# EAGLE design BSPD Test Board manufactured 2016-11-03 (EAGLE 7.7.0)
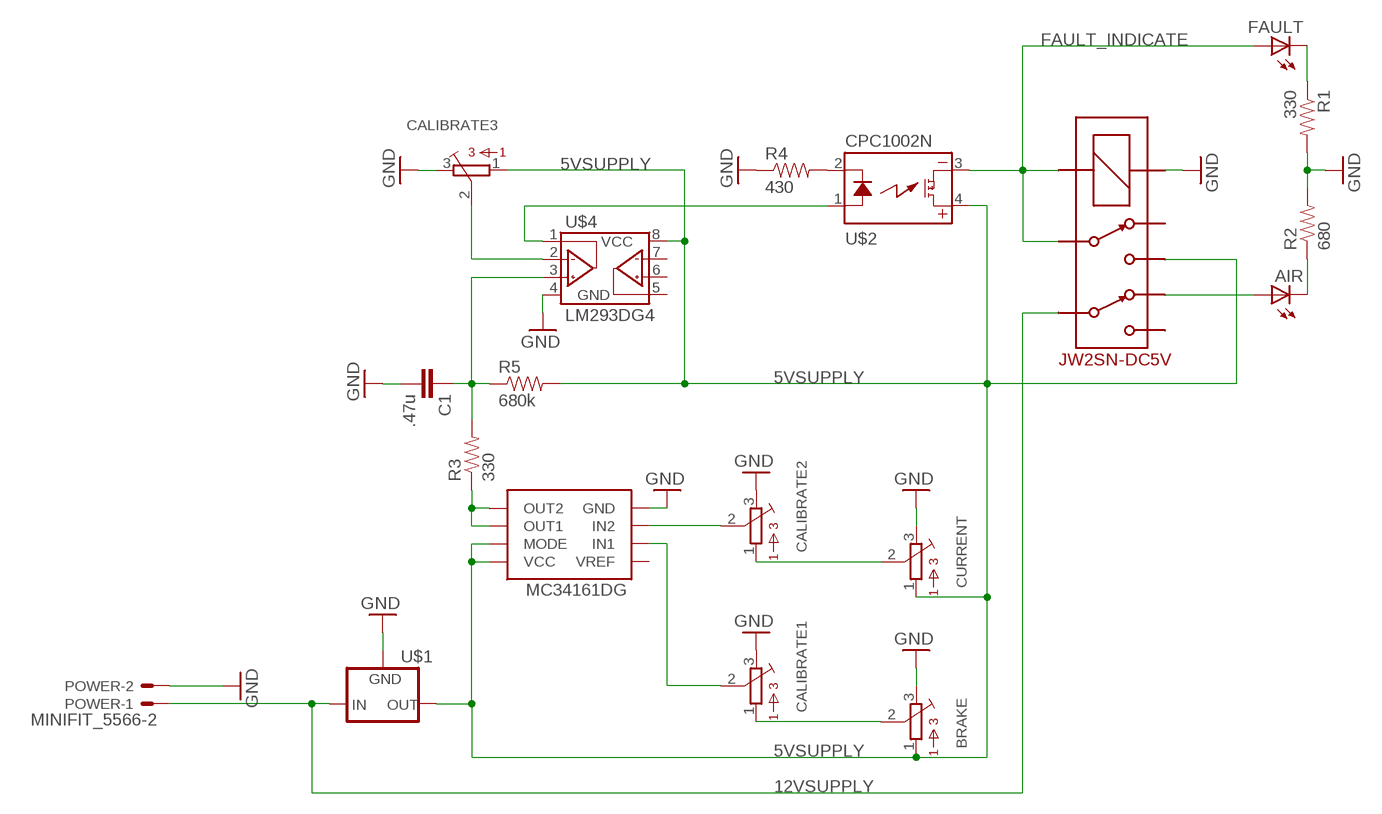
[diagram p0: schematic, sheet 1]

## Parts
AIR  LED-5MM  [LED-5MM]
BRAKE  TRIMPOT_3296C  [TRIMPOT_3296]
C1  .47u  CAPEZ  [CAP-PTH-SMALLEZ]
CALIBRATE1  TRIMPOT_3296C  [TRIMPOT_3296]
CALIBRATE2  TRIMPOT_3296C  [TRIMPOT_3296]
CALIBRATE3  TRIMPOT_3296C  [TRIMPOT_3296]
CURRENT  TRIMPOT_3296C  [TRIMPOT_3296]
FAULT  LED-5MM  [LED-5MM]
MC34161DG  VOLTAGE_MONITOR_MC34161DG  [SOIC-08]
POWER  MINIFIT_5566-2  [MINIFIT_5566-2]
R1  330  RESISTOR0805-RES  [0805]
R2  680  RESISTOR0805-RES  [0805]
R3  330  RESISTOR0805-RES  [0805]
R4  430  RESISTOR0805-RES  [0805]
R5  680k  RESISTOREZ  [AXIAL-0.3EZ]
U$1  5V_REGULATOR_LM340-NLM340MPX-5.0/NOPB  [SOT223]
U$2  CPC1002N  [SOP04]
U$3  DPDT_RELAY_PANASONIC_JW2SN-DC5V  [DPDT_RELAY_PANASONIC_JW2SN]
U$4  LM293DG4  [SOIC-08]

## Nets
5VSUPPLY: BRAKE.1 CALIBRATE3.1 CURRENT.1 MC34161DG.7(MODE) MC34161DG.8(VCC) R5.P$2 U$1.3(OUT) U$2.4(DC+) U$3.4 U$4.8(VCC)
12VSUPPLY: POWER.1 U$1.1(IN) U$3.6
FAULT_INDICATE: FAULT.A U$2.3(DC-) U$3.3 U$3.COIL-
GND: BRAKE.3 C1.2 CALIBRATE1.3 CALIBRATE2.3 CALIBRATE3.3 CURRENT.3 MC34161DG.4(GND) POWER.2 R1.2 R2.2 R4.1 U$1.2(GND) U$1.4(GND) U$3.COIL+ U$4.4(GND)
N$3: BRAKE.2 CALIBRATE1.1
N$4: CALIBRATE2.1 CURRENT.2
N$5: CALIBRATE2.2 MC34161DG.3(IN2)
N$6: CALIBRATE1.2 MC34161DG.2(IN1)
N$7: CALIBRATE3.2 U$4.2(1IN-)
N$8: FAULT.K(C) R1.1
N$9: U$2.1(CONTROL+) U$4.1(1OUT)
N$10: R4.2 U$2.2(CONTROL-)
N$11: AIR.A U$3.7
N$12: AIR.K(C) R2.1
N$13: C1.1 R3.2 R5.P$1 U$4.3(1IN+)
N$14: MC34161DG.5(OUT2) MC34161DG.6(OUT1) R3.1
Unconnected: MC34161DG.1(VREF) U$3.2 U$3.5 U$4.5(2IN+) U$4.6(2IN-) U$4.7(2OUT)

## Library data of the parts
AIR FAULT = HyTechDevices:LED: Light Emitting Diode (LED) Source: Dangerous Prototypes Eagle Library <https://github.com/DangerousPrototypes/Eagle_Part_Library>
BRAKE CALIBRATE1-CALIBRATE3 CURRENT = HyTechDevices:TRIMPOT_3296: 3296 Series 3/8" Square Trimmer Source <https://github.com/chiengineer/Eagle-Libraries/blob/master/Potentiometers/bourns.lbr>
C1 = HyTechDevices:CAP: Capacitor Standard 0603 ceramic capacitor, and 0.1" leaded capacitor.
MC34161DG = HyTechDevices:VOLTAGE_MONITOR_MC34161DG: Dual In Line / Socket
POWER = HyTechDevices:MINIFIT_5566-2: Mini-Fit Junior connector 2 pole Source: http://www.molex.com; OC_FARNELL: 1822072; OC_NEWARK: unknown
R1-R5 = HyTechDevices:RESISTOR: Resistor Basic schematic elements and footprints for 0603, 1206, and PTH resistors.
U$1 = HyTechDevices:5V_REGULATOR_LM340-N: Voltage Regulator 5v linear voltage regulator Datasheet <http://www.mouser.com/ProductDetail/Texas-Instruments/LM340MPX-50-NOPB/?qs=X1J7HmVL2ZGZwtTFRQ9ItA%3D%3D> MAX current out: 1.5A MAX voltage in: 35V
U$2 = HyTechDevices:CPC1002N: IXYS Solid State Relay .7A
U$3 = HyTechDevices:DPDT_RELAY_PANASONIC_JW2SN-DC5V: Double Pull Double Throw Relay 5VDC Datasheet <http://www.mouser.com/ds/2/316/jw-catalog-461998.pdf> Product Page <http://www.mouser.com/ProductDetail/Panasonic-Industrial-Devices/JW2SN-DC5V>
U$4 = HyTechDevices:LM293: Texas Instruments LM293 Dual Differential Comparator

## Board
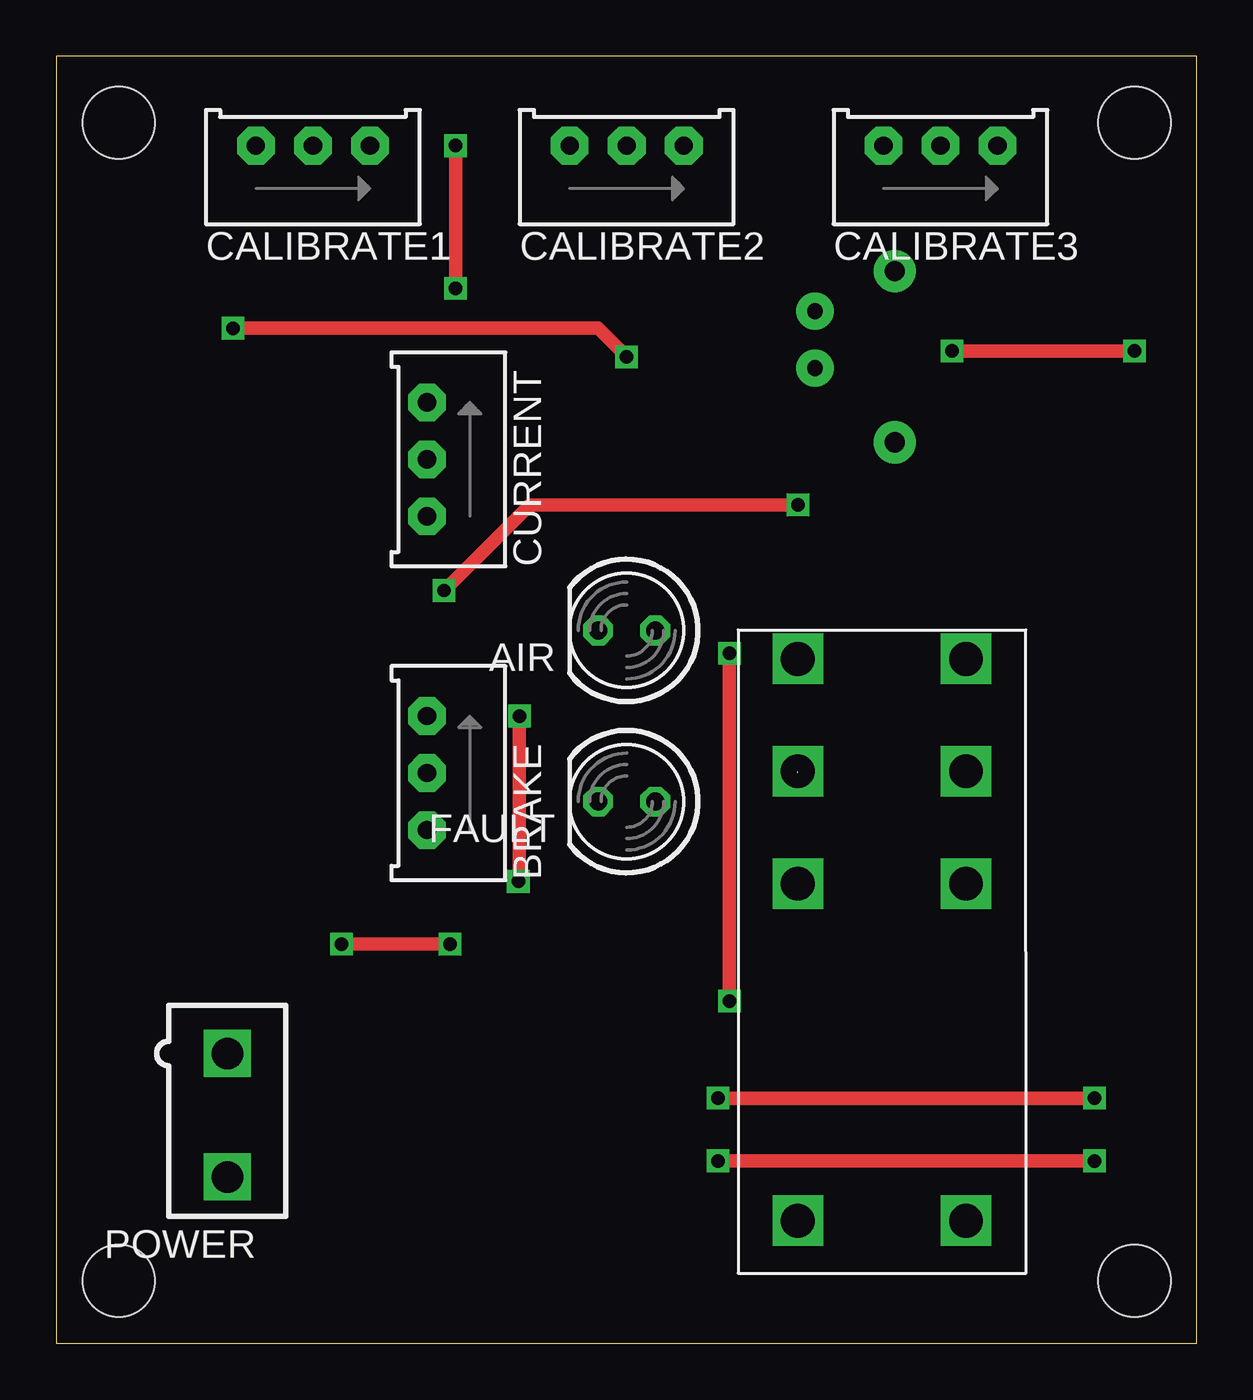
[diagram p1: board, top side]
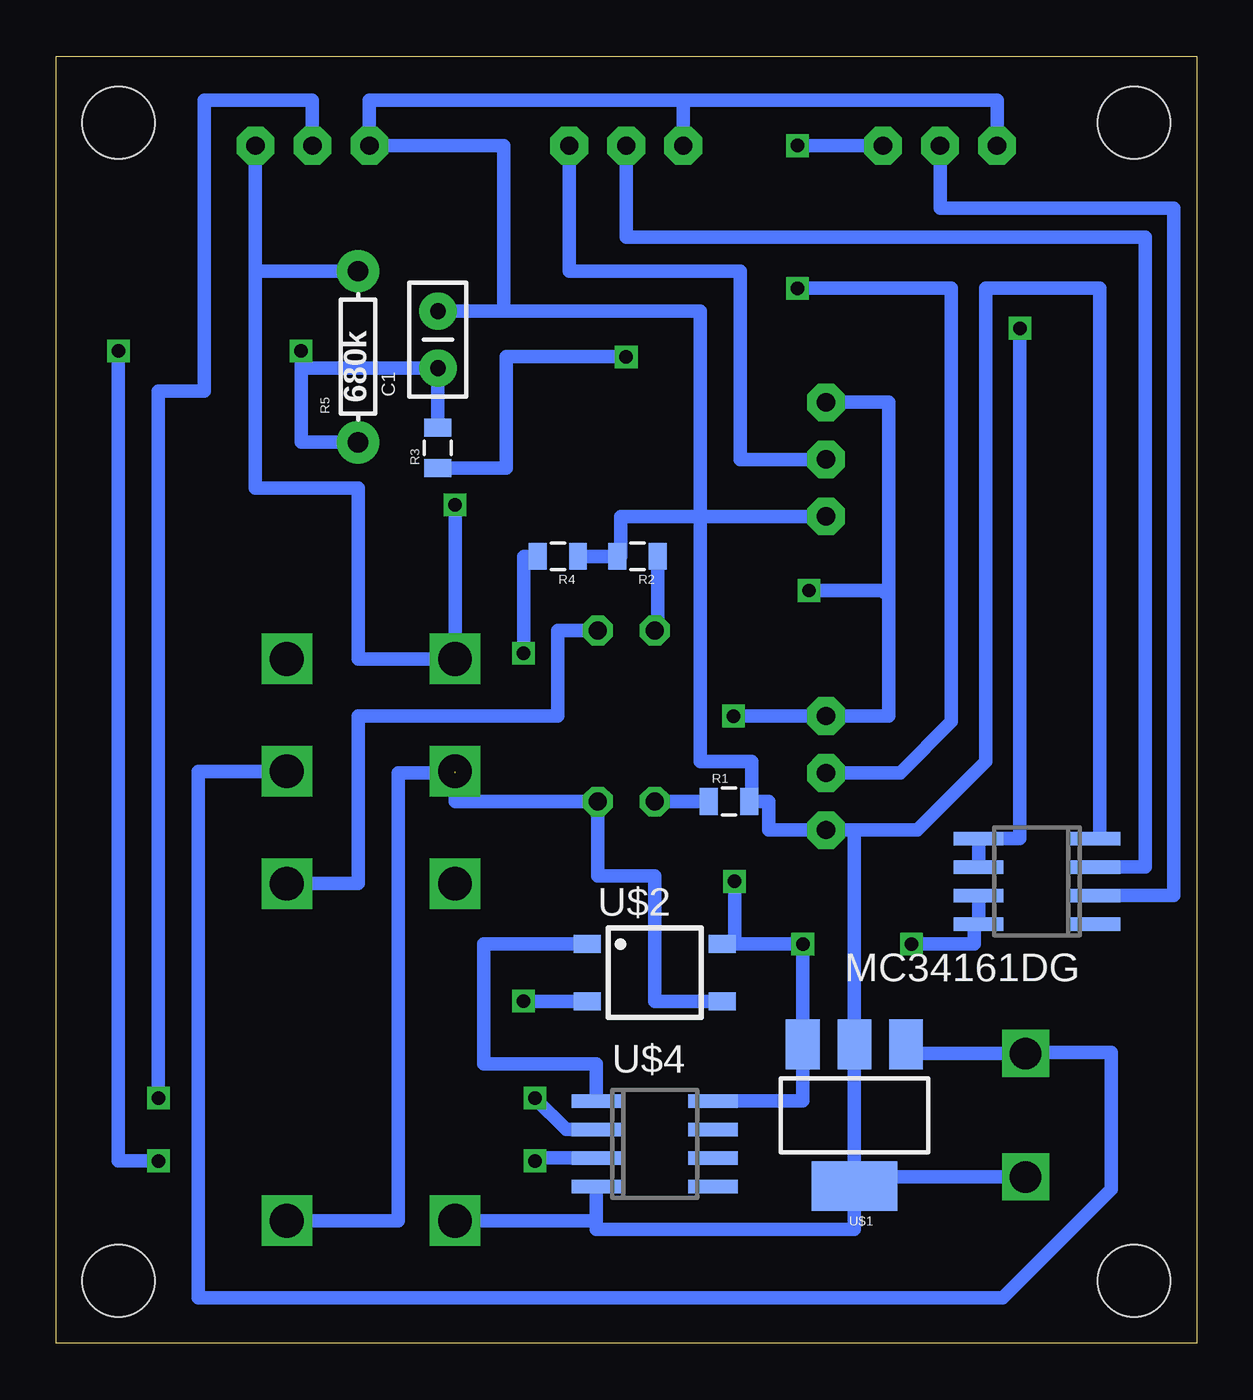
[diagram p2: board, bottom side, seen from below]

Size 50.78 x 57.33 mm. Coordinates in mm from the lower left corner, seen from the top.
Outline: 0,0 50.78,0 50.78,57.33 0,57.33 0,0
Copper layers (1*16): Top 0.035mm / dielectric 1.5mm / Bottom 0.035mm
Design rules "default": minimum track width 10mil, minimum drill 24mil, track to track 8mil, track to pad 8mil, pad to pad 8mil, via to via 8mil, smd to smd 8mil, copper to edge 40mil, drill to drill 8mil, minimum pad ring 10mil, minimum via ring 8mil, stop-mask expansion 4mil, vias tented up to drill 0mil, thermal gap 10mil
Holes 3.2 mm at 2.79,54.36 48.01,54.36 2.79,2.79 48.01,2.79

### Footprints (pad centres in the part's own frame; a part is rotated, then mirrored left to right if it is on the bottom)
LED-5MM = drill 0.813 octagon: A -1.27,0; K 1.27,0
TRIMPOT_3296 = drill 0.813 pad 1.676 octagon: 1 2.54,1.27; 2 0,1.27; 3 -2.54,1.27
CAP-PTH-SMALLEZ = drill 0.7 pad 1.651: 1 0,0; 2 2.54,0
SOIC-08 = smd 0.6 x 2.2: 1 -1.905,-2.6; 2 -0.635,-2.6; 3 0.635,-2.6; 4 1.905,-2.6; 5 1.905,2.6; 6 0.635,2.6; 7 -0.635,2.6; 8 -1.905,2.6
MINIFIT_5566-2 = drill 1.4 square: 1 0,-2.75; 2 0,2.75
0805 = smd 0.8 x 1.2: 1 -0.9,0; 2 0.9,0
AXIAL-0.3EZ = drill 0.9 pad 1.88: P$1 -3.81,0; P$2 3.81,0
SOT223 = smd 1.5 x 2.235: 1 -2.3,-3.15; 2 0,-3.15; 3 2.3,-3.15 | smd 3.8 x 2.2: 4 0,3.15
SOP04 = smd 0.8 x 1.2: 1 -1.27,-3; 2 1.27,-3; 3 1.27,3; 4 -1.27,3
DPDT_RELAY_PANASONIC_JW2SN = drill 1.5 square: 2 10.008,0; 3 5.004,0; 4 0,0; 5 0,7.493; 6 5.004,7.493; 7 10.008,7.493; COIL+ 25.019,0; COIL- 25.019,7.493

### Placement (x,y rotation side)
AIR  25.4,31.75 180 top
BRAKE  17.78,25.4 90 top
C1  33.78,43.43 90 bottom
CALIBRATE1  11.43,52.07 0 top
CALIBRATE2  25.4,52.07 0 top
CALIBRATE3  39.37,52.07 0 top
CURRENT  17.78,39.37 90 top
FAULT  25.4,24.13 180 top
MC34161DG  7.11,20.57 90 bottom
POWER  7.62,10.16 180 top
R1  20.83,24.13 0 bottom
R2  24.89,35.05 180 bottom
R3  33.78,39.88 90 bottom
R4  28.45,35.05 180 bottom
R5  37.34,43.94 90 bottom
U$1  15.24,10.16 180 bottom
U$2  24.13,16.51 270 bottom
U$3  33.02,30.48 270 top
U$4  24.13,8.89 270 bottom

### Tracks (layer width: path | path; a pad name or v marks a point on that pad's centre or on a via)
5VSUPPLY  (via drill 0.6)
  Top 0.61: v12.7,17.78 v17.54,17.78 | v20.57,20.57 20.62,20.57 v20.62,27.94 | v33.02,37.34 21.08,37.34 v17.27,33.53
  Bottom 0.61: U$4.8 17.54,10.79 U$1.3 v17.54,17.78 20.57,17.78 | MC34161DG.7 MC34161DG.8 9.91,18.67 9.91,17.78 v12.7,17.78 | CURRENT.1 13.72,41.91 13.72,33.27 | 13.72,33.27 13.72,27.94 BRAKE.1 v20.62,27.94 | 41.91,47.75 41.91,38.1 37.34,38.1 37.34,30.48 U$3.4 v33.02,37.34 | 41.91,47.75 CALIBRATE3.1 | U$2.4 20.57,17.78 | 20.57,17.78 v20.57,20.57 | v17.27,33.53 13.97,33.53 13.72,33.27 | R5.P$2 41.91,47.75
12VSUPPLY
  Bottom 0.61: POWER.1 8.13,12.91 | 8.13,12.91 12.94,12.91 U$1.1 | U$3.6 44.45,25.48 44.45,2.03 8.64,2.03 3.81,6.86 3.81,12.95 8.13,12.95 8.13,12.91
FAULT_INDICATE  (1 unrouted)
  Bottom 0.61: U$3.COIL- 35.56,5.46 35.56,25.4 33.02,25.4 33.02,24.13 FAULT.A 26.67,20.83 24.13,20.83 24.13,15.24 U$2.3
GND
  Bottom 0.61: POWER.2 15.24,7.41 U$1.4 | U$1.4 U$1.2 15.24,22.86 | U$1.4 15.24,5.08 26.73,5.08 26.73,5.46 | 26.73,5.46 U$4.4 | 15.24,22.86 BRAKE.3 19.05,22.86 19.05,24.13 R1.2 19.81,24.13 19.81,25.91 22.1,25.91 22.1,36.83 | 22.86,55.37 36.83,55.37 CALIBRATE3.3 30.85,53.34 30.85,45.97 | 30.85,45.97 22.1,45.97 22.1,36.83 | MC34161DG.4 4.32,22.48 4.32,46.99 9.4,46.99 9.4,25.91 12.45,22.86 15.24,22.86 | 22.86,55.37 CALIBRATE2.3 | CALIBRATE1.3 8.89,55.37 22.86,55.37 | R4.1 R2.2 25.65,35.05 25.65,36.83 22.1,36.83 | CURRENT.3 22.1,36.83 | U$3.COIL+ 26.73,5.46 | C1.2 30.85,45.97
N$3  (via drill 0.6)
  Top 0.61: v17.78,53.34 v17.78,46.99
  Bottom 0.61: CALIBRATE1.1 v17.78,53.34 | v17.78,46.99 10.92,46.99 10.92,27.69 13.21,25.4 BRAKE.2
N$4
  Bottom 0.61: CALIBRATE2.1 27.94,47.75 20.32,47.75 20.32,39.37 CURRENT.2
N$5
  Bottom 0.61: CALIBRATE2.2 25.4,49.28 2.29,49.28 2.29,21.21 MC34161DG.3
N$6
  Bottom 0.61: CALIBRATE1.2 11.43,50.55 1.02,50.55 1.02,19.94 MC34161DG.2
N$7  (via drill 0.6)
  Top 0.61: v29.46,10.92 v46.23,10.92
  Bottom 0.61: CALIBRATE3.2 39.37,55.37 44.2,55.37 44.2,42.42 46.23,42.42 v46.23,10.92 | U$4.2 28.07,9.53 v29.46,10.92
N$8
  Bottom 0.61: 23.99,24.13 FAULT.K R1.1
N$9
  Bottom 0.61: U$2.1 31.75,17.78 31.75,12.45 26.73,12.45 U$4.1 26.73,10.92
N$10  (via drill 0.6)
  Top 0.61: v29.97,30.73 v29.97,15.24
  Bottom 0.61: R4.2 29.97,35.05 v29.97,30.73 | v29.97,15.24 U$2.2
N$11
  Bottom 0.61: U$3.7 37.34,20.47 37.34,27.94 28.45,27.94 28.45,31.75 AIR.A
N$12
  Bottom 0.61: AIR.K 23.99,31.75 R2.1
N$13  (via drill 0.6)
  Top 0.61: v29.46,8.13 v46.23,8.13 | v48.01,44.2 v39.88,44.2
  Bottom 0.61: U$4.3 29.46,8.26 v29.46,8.13 | v46.23,8.13 48.01,8.13 v48.01,44.2 | R5.P$1 39.88,40.13 39.88,43.43 | v39.88,44.2 39.88,43.69 39.88,43.43 | R3.2 C1.1 39.88,43.43
N$14  (via drill 0.6)
  Top 0.61: v7.87,45.21 24.13,45.21 v25.4,43.94
  Bottom 0.61: MC34161DG.6 MC34161DG.5 7.87,22.48 v7.87,45.21 | R3.1 30.73,38.98 30.73,43.94 v25.4,43.94